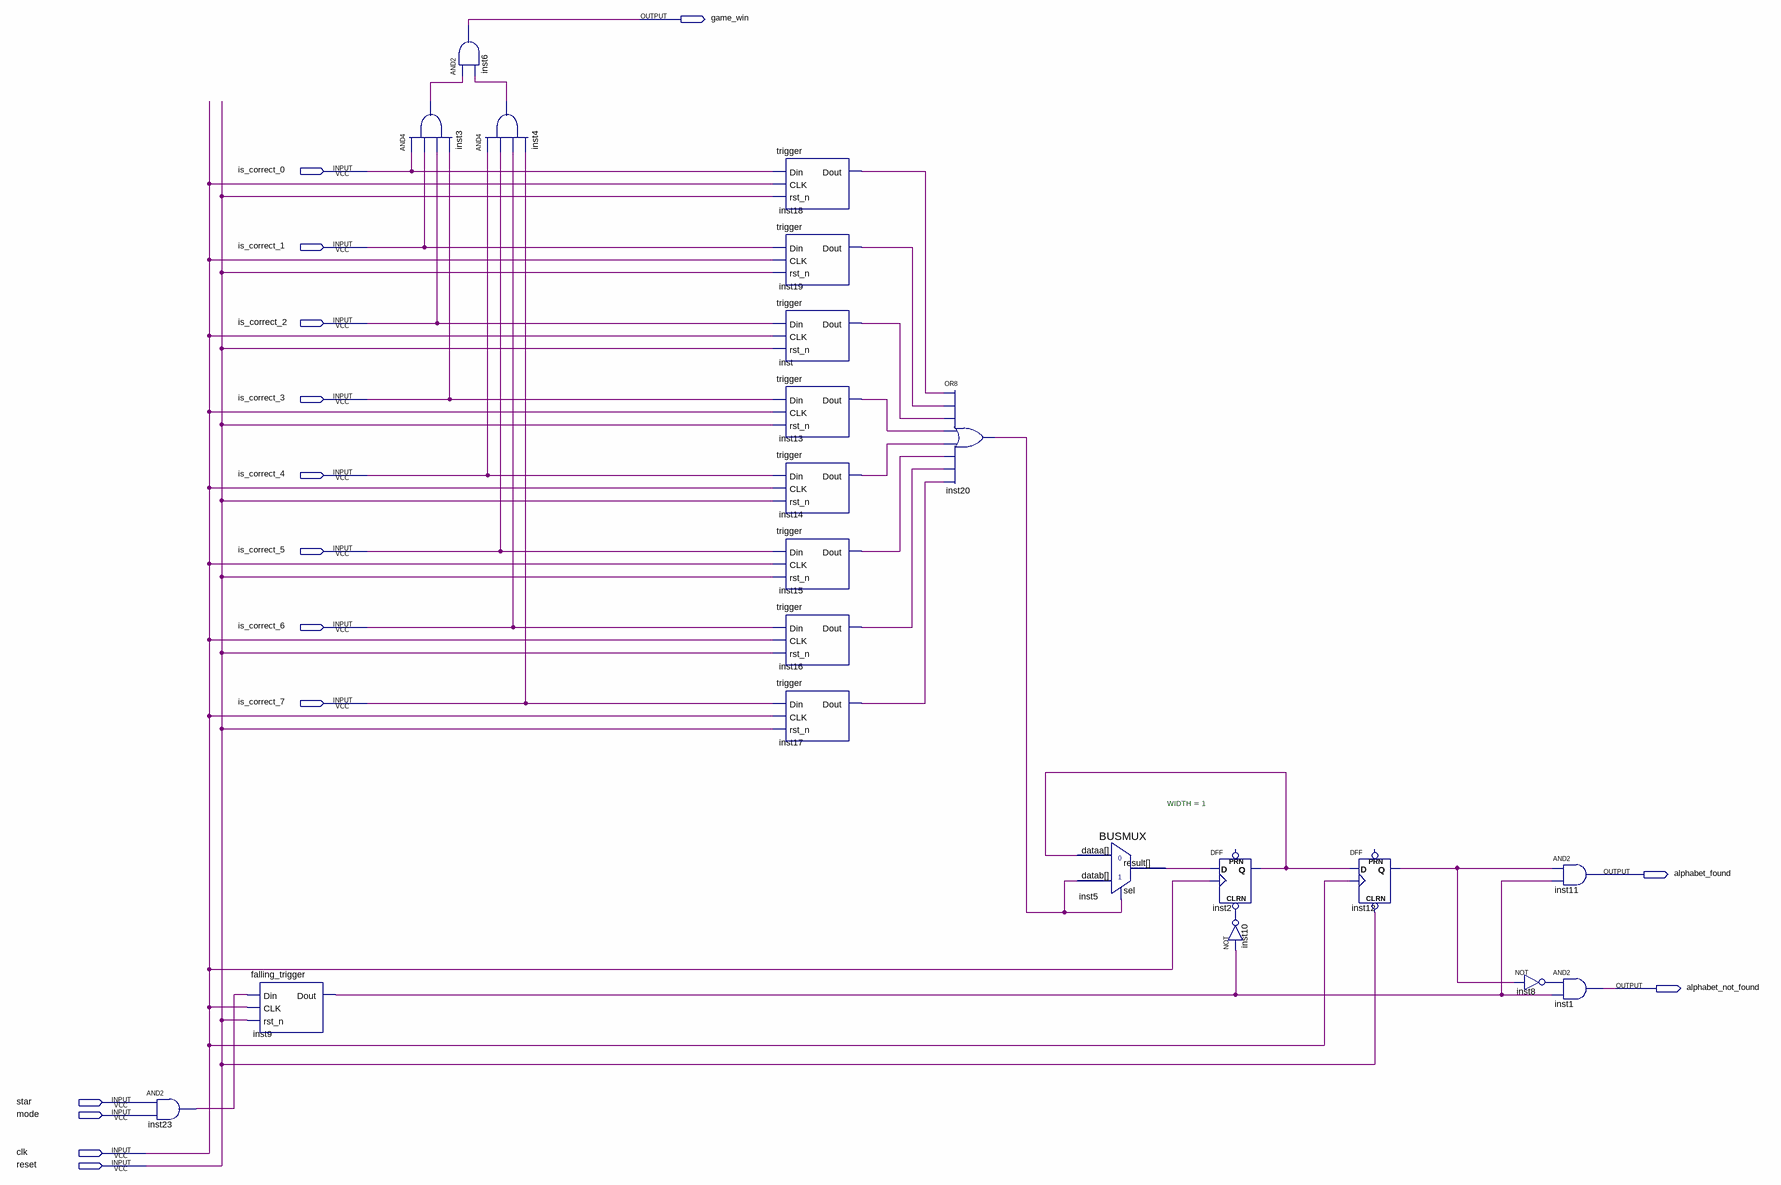
[diagram p0: schematic sheet]
// Quartus schematic grader.bdf as structural Verilog: 21 symbols, 15 pins
module grader (
  input  is_correct_0,
  input  is_correct_1,
  input  is_correct_2,
  input  is_correct_3,
  input  is_correct_4,
  input  is_correct_5,
  input  is_correct_6,
  input  is_correct_7,
  input  star,
  input  mode,
  input  clk,
  input  reset,
  output game_win,
  output alphabet_found,
  output alphabet_not_found
);

  wire inst2_q, inst3_out, inst4_out, inst5_result, inst8_out, inst9_dout, inst10_out, inst12_q, inst13_dout,
       inst14_dout, inst15_dout, inst16_dout, inst17_dout, inst18_dout, inst19_dout, inst20_out, inst23_out,
       inst_dout;

  and inst23 (inst23_out, star, mode);
  falling_trigger inst9 (.Din(inst23_out), .CLK(clk), .rst_n(reset), .Dout(inst9_dout));
  and inst3 (inst3_out, is_correct_0, is_correct_1, is_correct_2, is_correct_3);
  and inst6 (game_win, inst3_out, inst4_out);
  and inst4 (inst4_out, is_correct_4, is_correct_5, is_correct_6, is_correct_7);
  trigger inst18 (.Din(is_correct_0), .CLK(clk), .rst_n(reset), .Dout(inst18_dout));
  trigger inst19 (.Din(is_correct_1), .CLK(clk), .rst_n(reset), .Dout(inst19_dout));
  trigger inst (.Din(is_correct_2), .CLK(clk), .rst_n(reset), .Dout(inst_dout));
  trigger inst13 (.Din(is_correct_3), .CLK(clk), .rst_n(reset), .Dout(inst13_dout));
  trigger inst14 (.Din(is_correct_4), .CLK(clk), .rst_n(reset), .Dout(inst14_dout));
  trigger inst15 (.Din(is_correct_5), .CLK(clk), .rst_n(reset), .Dout(inst15_dout));
  trigger inst16 (.Din(is_correct_6), .CLK(clk), .rst_n(reset), .Dout(inst16_dout));
  trigger inst17 (.Din(is_correct_7), .CLK(clk), .rst_n(reset), .Dout(inst17_dout));
  or inst20 (inst20_out, inst18_dout, inst19_dout, inst_dout, inst13_dout, inst14_dout, inst15_dout, inst16_dout, inst17_dout);
  BUSMUX #(.WIDTH(1)) inst5 (.datab(inst20_out), .sel(inst20_out), .dataa(inst2_q), .result(inst5_result));
  DFF inst2 (.CLRN(inst10_out), .CLK(clk), .D(inst5_result), .Q(inst2_q));  // open: PRN
  not inst10 (inst10_out, inst9_dout);
  DFF inst12 (.CLRN(reset), .CLK(clk), .D(inst2_q), .Q(inst12_q));  // open: PRN
  not inst8 (inst8_out, inst12_q);
  and inst11 (alphabet_found, inst12_q, inst9_dout);
  and inst1 (alphabet_not_found, inst8_out, inst9_dout);
endmodule
